# EAGLE schematic IV6 general schema (EAGLE 6.3)
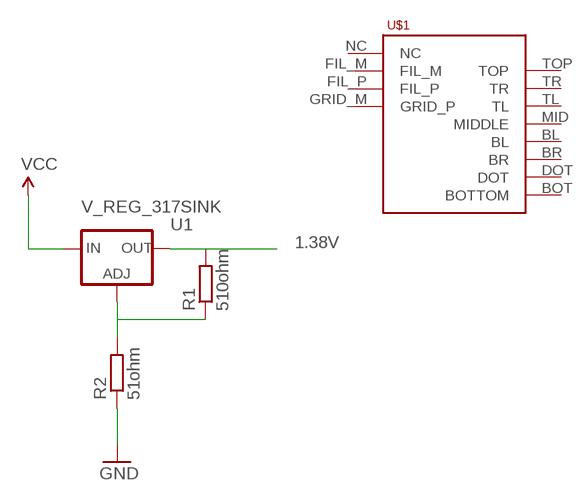
[diagram p0: schematic, sheet 1]

## Parts
R1  510ohm  R-EU_0204/7  [0204/7]
R2  51ohm  R-EU_0204/7  [0204/7]
U1  V_REG_317SINK  [TO220-ADJ]
U$1  IV6_NUMITRON  [IV6_NUMITRON_PAC]

## Nets
GND: R2.1
N$1: R1.2 U1.OUT
N$2: R1.1 R2.2 U1.ADJ
VCC: U1.IN
Unconnected: U$1.BL U$1.BOT(BOTTOM) U$1.BR U$1.DOT U$1.FIL_M U$1.FIL_P U$1.GRID_M(GRID_P) U$1.MID(MIDDLE) U$1.NC U$1.TL U$1.TOP U$1.TR

## Notes on the sheet
- 1.38V

## Library data of the parts
R1 R2 = resistor:R-EU_: RESISTOR, European symbol
U1 = SparkFun-PowerIC:V_REG_317: Voltage Regulator Standard LM317 adjustable voltage regulator. AOI (Adjust Output Input). Google 'LM317 Calculator' for easy to use app to get the two resistor values needed. 240/720 for 5V output. 240/390 for 3.3V output. Spark Fun Electronics SKU : COM-00527
U$1 = kalshagar:IV6_NUMITRON